# Altium schematic sheet FPGA - Decoupling.SchDoc
size A4
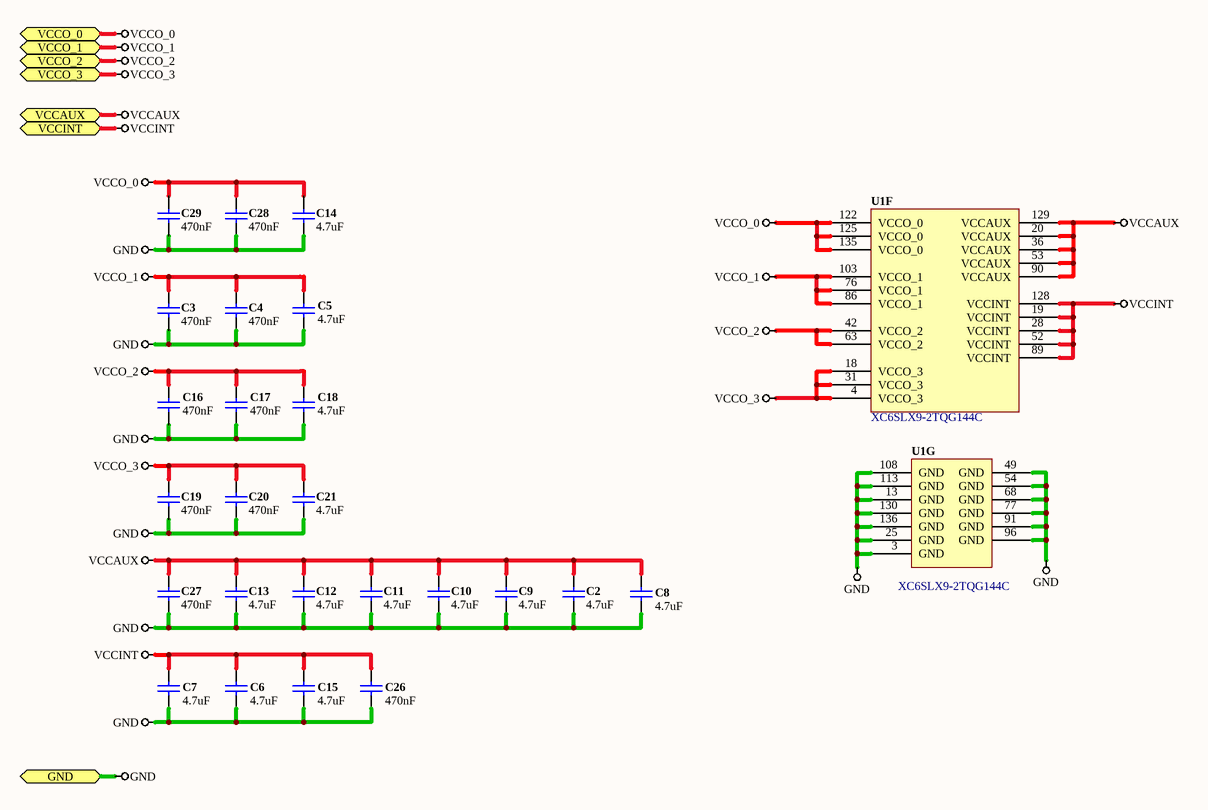
[diagram p0: FPGA - Decoupling.SchDoc]

## Parts
C2  value 4.7uF  [CAPC0603(1608)55_L]  (hidden comment: CAP 4.7uF 10V 0603(1608))
C3  value 470nF  [CAPC0402(1005)60_L]  (hidden comment: CAP 470nF 10V 0402(1005))
C4  value 470nF  [CAPC0402(1005)60_L]  (hidden comment: CAP 470nF 10V 0402(1005))
C5  value 4.7uF  [CAPC0603(1608)55_L]  (hidden comment: CAP 4.7uF 10V 0603(1608))
C6  value 4.7uF  [CAPC0603(1608)55_L]  (hidden comment: CAP 4.7uF 10V 0603(1608))
C7  value 4.7uF  [CAPC0603(1608)55_L]  (hidden comment: CAP 4.7uF 10V 0603(1608))
C8  value 4.7uF  [CAPC0603(1608)55_L]  (hidden comment: CAP 4.7uF 10V 0603(1608))
C9  value 4.7uF  [CAPC0603(1608)55_L]  (hidden comment: CAP 4.7uF 10V 0603(1608))
C10  value 4.7uF  [CAPC0603(1608)55_L]  (hidden comment: CAP 4.7uF 10V 0603(1608))
C11  value 4.7uF  [CAPC0603(1608)55_L]  (hidden comment: CAP 4.7uF 10V 0603(1608))
C12  value 4.7uF  [CAPC0603(1608)55_L]  (hidden comment: CAP 4.7uF 10V 0603(1608))
C13  value 4.7uF  [CAPC0603(1608)55_L]  (hidden comment: CAP 4.7uF 10V 0603(1608))
C14  value 4.7uF  [CAPC0603(1608)55_L]  (hidden comment: CAP 4.7uF 10V 0603(1608))
C15  value 4.7uF  [CAPC0603(1608)55_L]  (hidden comment: CAP 4.7uF 10V 0603(1608))
C16  value 470nF  [CAPC0402(1005)60_L]  (hidden comment: CAP 470nF 10V 0402(1005))
C17  value 470nF  [CAPC0402(1005)60_L]  (hidden comment: CAP 470nF 10V 0402(1005))
C18  value 4.7uF  [CAPC0603(1608)55_L]  (hidden comment: CAP 4.7uF 10V 0603(1608))
C19  value 470nF  [CAPC0402(1005)60_L]  (hidden comment: CAP 470nF 10V 0402(1005))
C20  value 470nF  [CAPC0402(1005)60_L]  (hidden comment: CAP 470nF 10V 0402(1005))
C21  value 4.7uF  [CAPC0603(1608)55_L]  (hidden comment: CAP 4.7uF 10V 0603(1608))
C26  value 470nF  [CAPC0402(1005)60_L]  (hidden comment: CAP 470nF 10V 0402(1005))
C27  value 470nF  [CAPC0402(1005)60_L]  (hidden comment: CAP 470nF 10V 0402(1005))
C28  value 470nF  [CAPC0402(1005)60_L]  (hidden comment: CAP 470nF 10V 0402(1005))
C29  value 470nF  [CAPC0402(1005)60_L]  (hidden comment: CAP 470nF 10V 0402(1005))
U1  XC6SLX9-2TQG144C  [TQG144_N]  (parts F,G of 7)

## Ports
GND, VCCAUX, VCCINT, VCCO_0, VCCO_1, VCCO_2, VCCO_3

## Nets
GND: C2.2 C3.1 C4.1 C5.2 C6.2 C7.2 C8.2 C9.2 C10.2 C11.2 C12.2 C13.2 C14.1 C15.2 C16.1 C17.1 C18.1 C19.1 C20.1 C21.1 C26.2 C27.2 C28.1 C29.1 U1.3(GND) U1.13(GND) U1.25(GND) U1.49(GND) U1.54(GND) U1.68(GND) U1.77(GND) U1.91(GND) U1.96(GND) U1.108(GND) U1.113(GND) U1.130(GND) U1.136(GND) ; port GND
VCCAUX: C2.1 C8.1 C9.1 C10.1 C11.1 C12.1 C13.1 C27.1 U1.20(VCCAUX) U1.36(VCCAUX) U1.53(VCCAUX) U1.90(VCCAUX) U1.129(VCCAUX) ; port VCCAUX
VCCINT: C6.1 C7.1 C15.1 C26.1 U1.19(VCCINT) U1.28(VCCINT) U1.52(VCCINT) U1.89(VCCINT) U1.128(VCCINT) ; port VCCINT
VCCO_0: C14.2 C28.2 C29.2 U1.122(VCCO_0) U1.125(VCCO_0) U1.135(VCCO_0) ; port VCCO_0
VCCO_1: C3.2 C4.2 C5.1 U1.76(VCCO_1) U1.86(VCCO_1) U1.103(VCCO_1) ; port VCCO_1
VCCO_2: C16.2 C17.2 C18.2 U1.42(VCCO_2) U1.63(VCCO_2) ; port VCCO_2
VCCO_3: C19.2 C20.2 C21.2 U1.4(VCCO_3) U1.18(VCCO_3) U1.31(VCCO_3) ; port VCCO_3

## Library data of the parts
C2 C5-C15 C18 C21 = CAP 4.7uF 10V ±10% 0603 (1608 Metric) Thickness 0.55mm SMD: Manufacturer_PN: CC0603KRX5R6BB475; Case-Metric: 1608; Case-EIA: 0603; Tolerance: ±10%; Rated Voltage: 10 V; Technology: SMT; Max Thickness: 0.55 mm; Manufacturer Part Number: CC0603KRX5R6BB475
C3 C4 C16 C17 C19 C20 C26-C29 = CAP 470nF 10V ±10% 0402 (1005 Metric) Thickness 0.6mm SMD: Manufacturer_PN: LMK105BJ474KV-F; Case-Metric: 1005; Case-EIA: 0402; Tolerance: ±10%; Rated Voltage: 10 V; Max Thickness: 0.6 mm; Technology: SMT; Manufacturer Part Number: LMK105BJ474KV-F
U1 = CMP-0067-00454-1: Spartan-6 LX 1.2V FPGA, 102 User I/Os, 144-Pin TQFP (0.5mm Pitch), Speed Grade 2, Commercial Grade, Pb-Free; PackageVersion: ver1.2, Jun-2004; DatasheetVersion: ver1.6, Nov-2010; PackageDescription: 144-Pin Thin Quad Flat Pack (TQG144) - Pb-Free; PackageReference: TQG144; Code_JEDEC: MS-026-BFB; Manufacturer_PN: XC6SLX9-2TQG144C; Manufacturer Part Number: XC6SLX9-2TQG144C